# EAGLE design 5p ATtiny adapter (EAGLE 7.6.0)
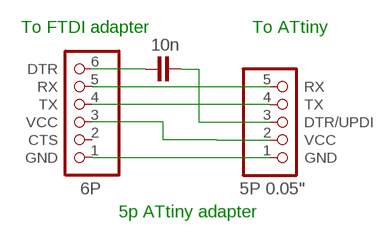
[diagram p0: schematic, sheet 1]

## Parts
C1  10n  SMD-C-0603-SMALL  [0603-SMALL]
J1  6P  FTDIHEADER  [1X06]
J2  5P 0.05"  ZIGZAG-FTDI-UPDI-5P"  [FTDI-UPDI-5P]

## Nets
5V: J1.3(VCC) J2.2(VCC)
GND: J1.1(GND) J2.1(GND)
N$6: C1.2 J2.3(DTR/UPDI)
N$7: C1.1 J1.6(DTR)
N$8: J1.5(RX) J2.5(RX)
N$9: J1.4(TX) J2.4(TX)
Unconnected: J1.2(CTS)

## Notes on the sheet
- To FTDI adapter | To ATtiny
- 5p ATtiny adapter

## Library data of the parts
C1 = Albert:SMD-C: Capacitors
J1 = Albert:FTDI
J2 = Albert:ZIGZAG-FTDI-UPDI-5P

## Board
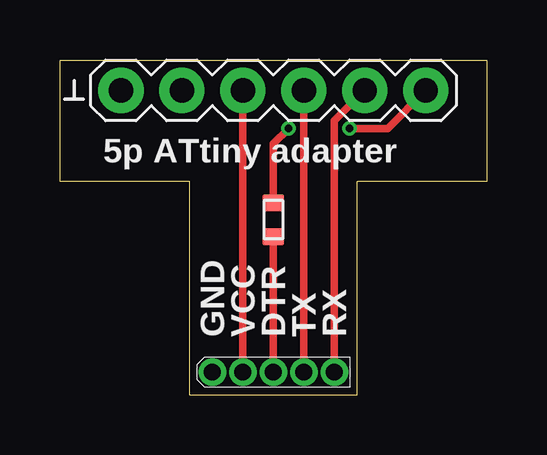
[diagram p1: board, top side]
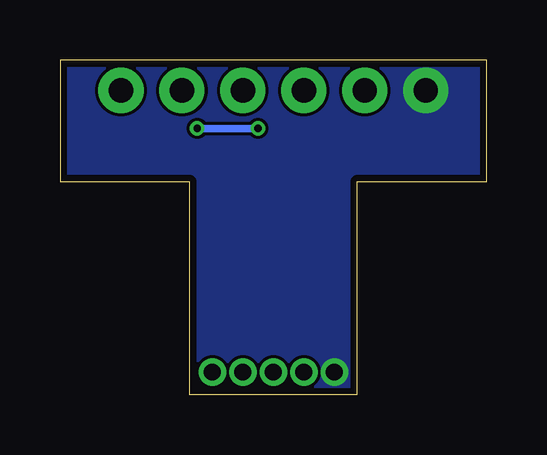
[diagram p2: board, bottom side, seen from below]

Size 17.78 x 13.97 mm. Coordinates in mm from the lower left corner, seen from the top.
Outline: 5.4,0 12.38,0 12.38,8.89 17.78,8.89 17.78,13.97 0,13.97 0,8.89 5.4,8.89 5.4,0
Copper layers (1*16): Top 0.035mm / dielectric 1.5mm / Bottom 0.035mm
Design rules "Albert 5mil": minimum track width 5mil, minimum drill 0.3mm, track to track 5mil, track to pad 5mil, pad to pad 5mil, via to via 5mil, smd to smd 5mil, copper to edge 10mil, drill to drill 8mil, minimum pad ring 8.5mil, minimum via ring 6mil, stop-mask expansion 4mil, vias tented up to drill 25mil, thermal gap 10mil

### Footprints (pad centres in the part's own frame; a part is rotated, then mirrored left to right if it is on the bottom)
0603-SMALL = smd 0.9 x 0.7: 1 0,0.7; 2 0,-0.7
1X06 = drill 1.016 pad 1.88: 1 0,0; 2 2.54,0; 3 5.08,0; 4 7.62,0; 5 10.16,0; 6 12.7,0
FTDI-UPDI-5P = drill 0.7 pad 1.143: 1 0,0; 2 1.27,0; 3 2.54,0; 4 3.81,0; 5 5.08,0

### Placement (x,y rotation side)
C1  8.89,7.3 0 top
J1  2.54,12.7 0 top
J2  6.35,0.95 0 top

### Tracks (layer width: path | path; a pad name or v marks a point on that pad's centre or on a via)
5V
  Top 0.305: J2.2 J1.3
GND
  pour Bottom (no thermals): 0,13.97 17.78,13.97 17.78,8.89 12.38,8.89 12.38,0 5.4,0 5.4,8.89 0,8.89
N$6
  Top 0.305: J2.3 C1.2
N$7  (via drill 0.3)
  Top 0.305: C1.1 8.89,10.48 v9.53,11.11 | v12.06,11.11 13.65,11.11 J1.6
  Bottom 0.305: v9.53,11.11 v12.06,11.11
N$8
  Top 0.305: J2.5 11.43,11.43 J1.5
N$9
  Top 0.305: J2.4 J1.4

### Text on the board
tNames: 5p ATtiny adapter | GND | VCC | DTR | TX | RX